# EAGLE design electric-skateboard-v2 (EAGLE 6.6.0)

## Sheet 1 of 2: SIGNAL
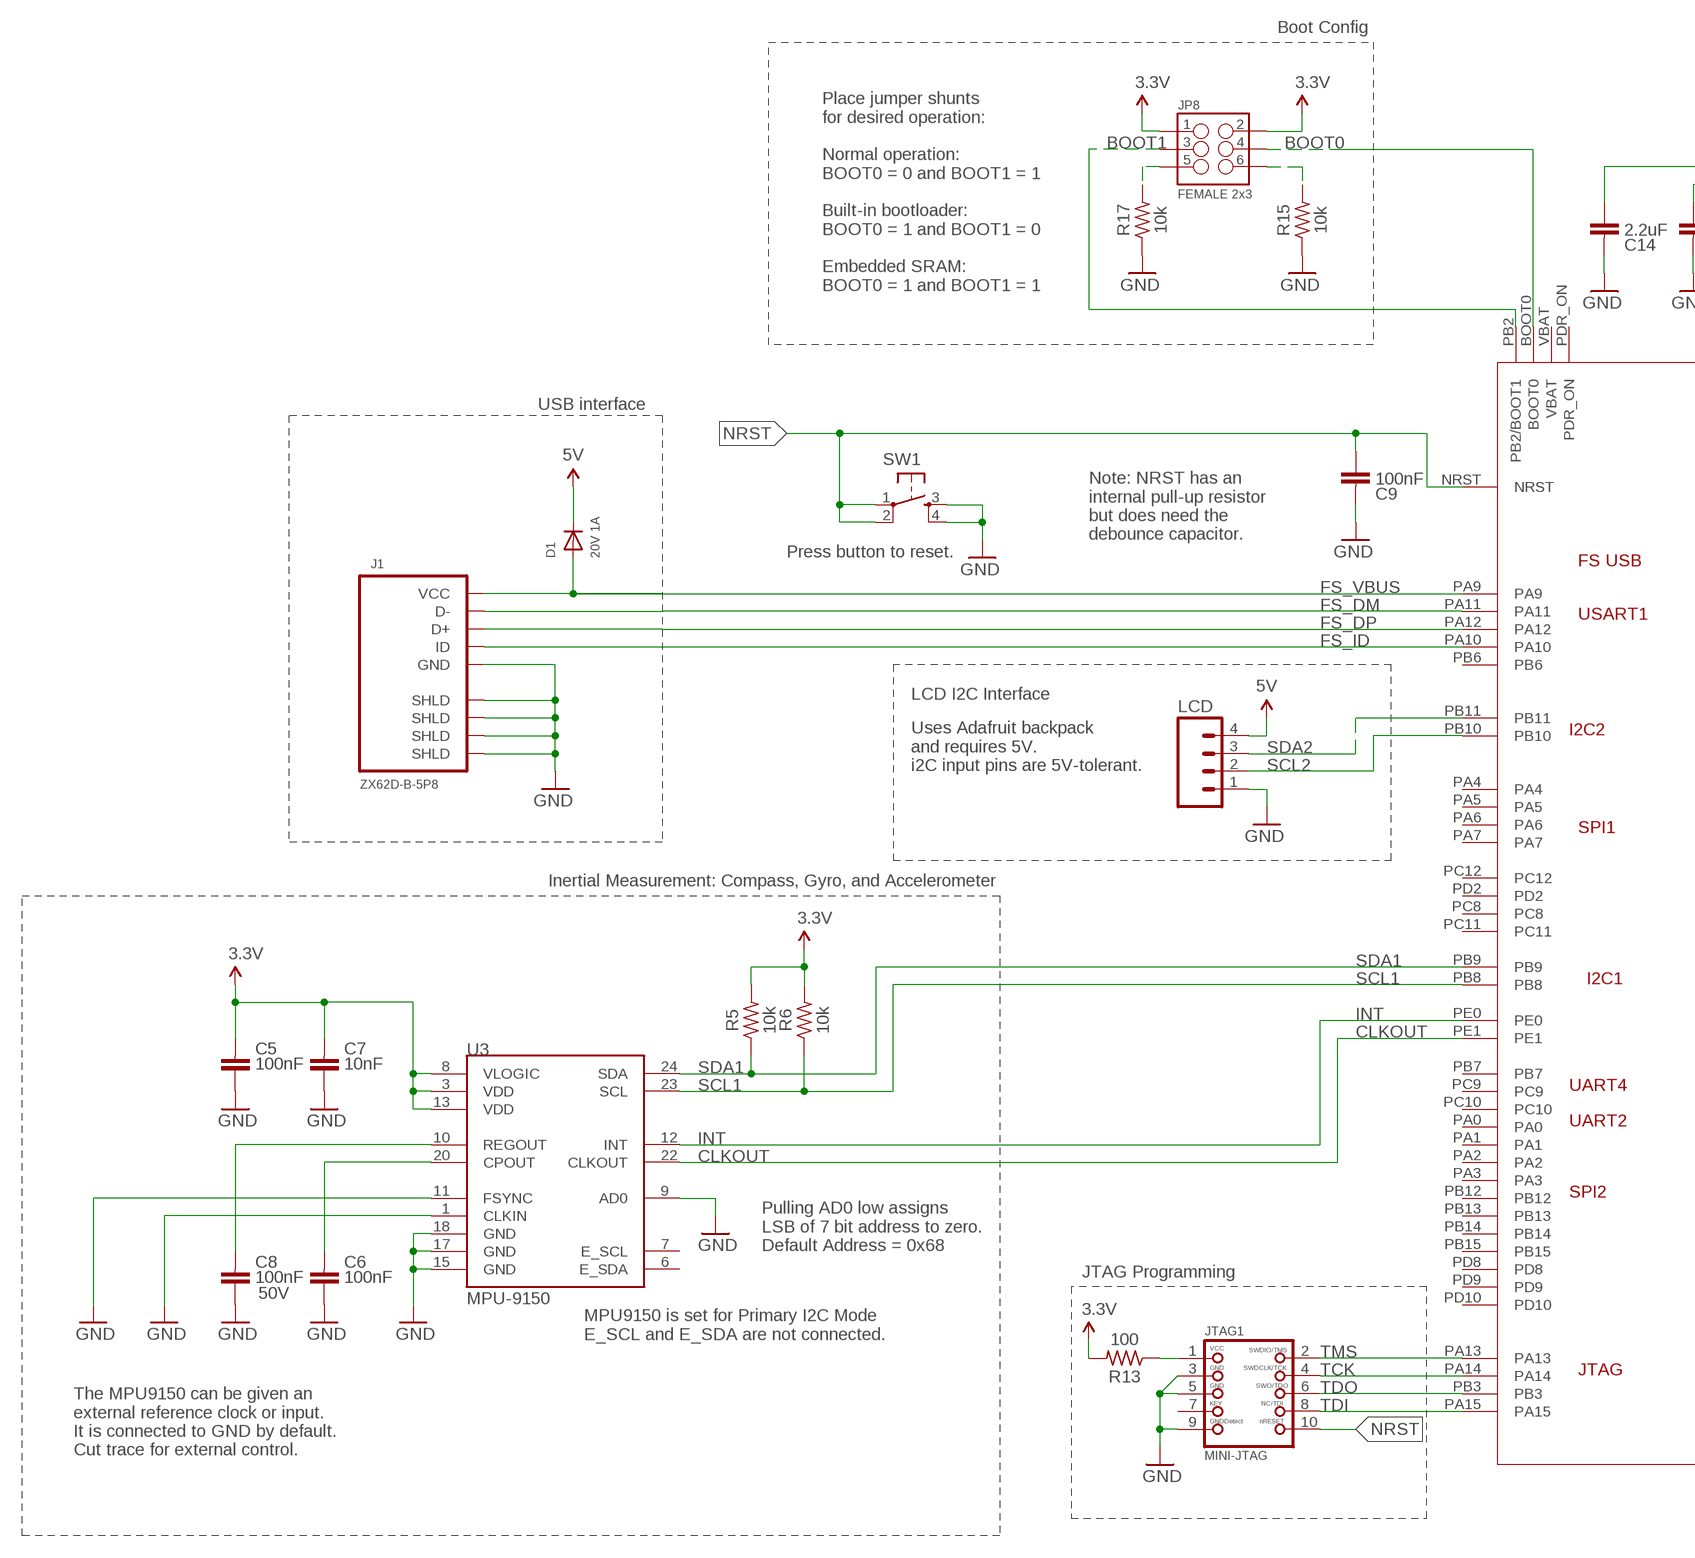
[diagram p0: schematic, sheet 1, part 1 of 2]
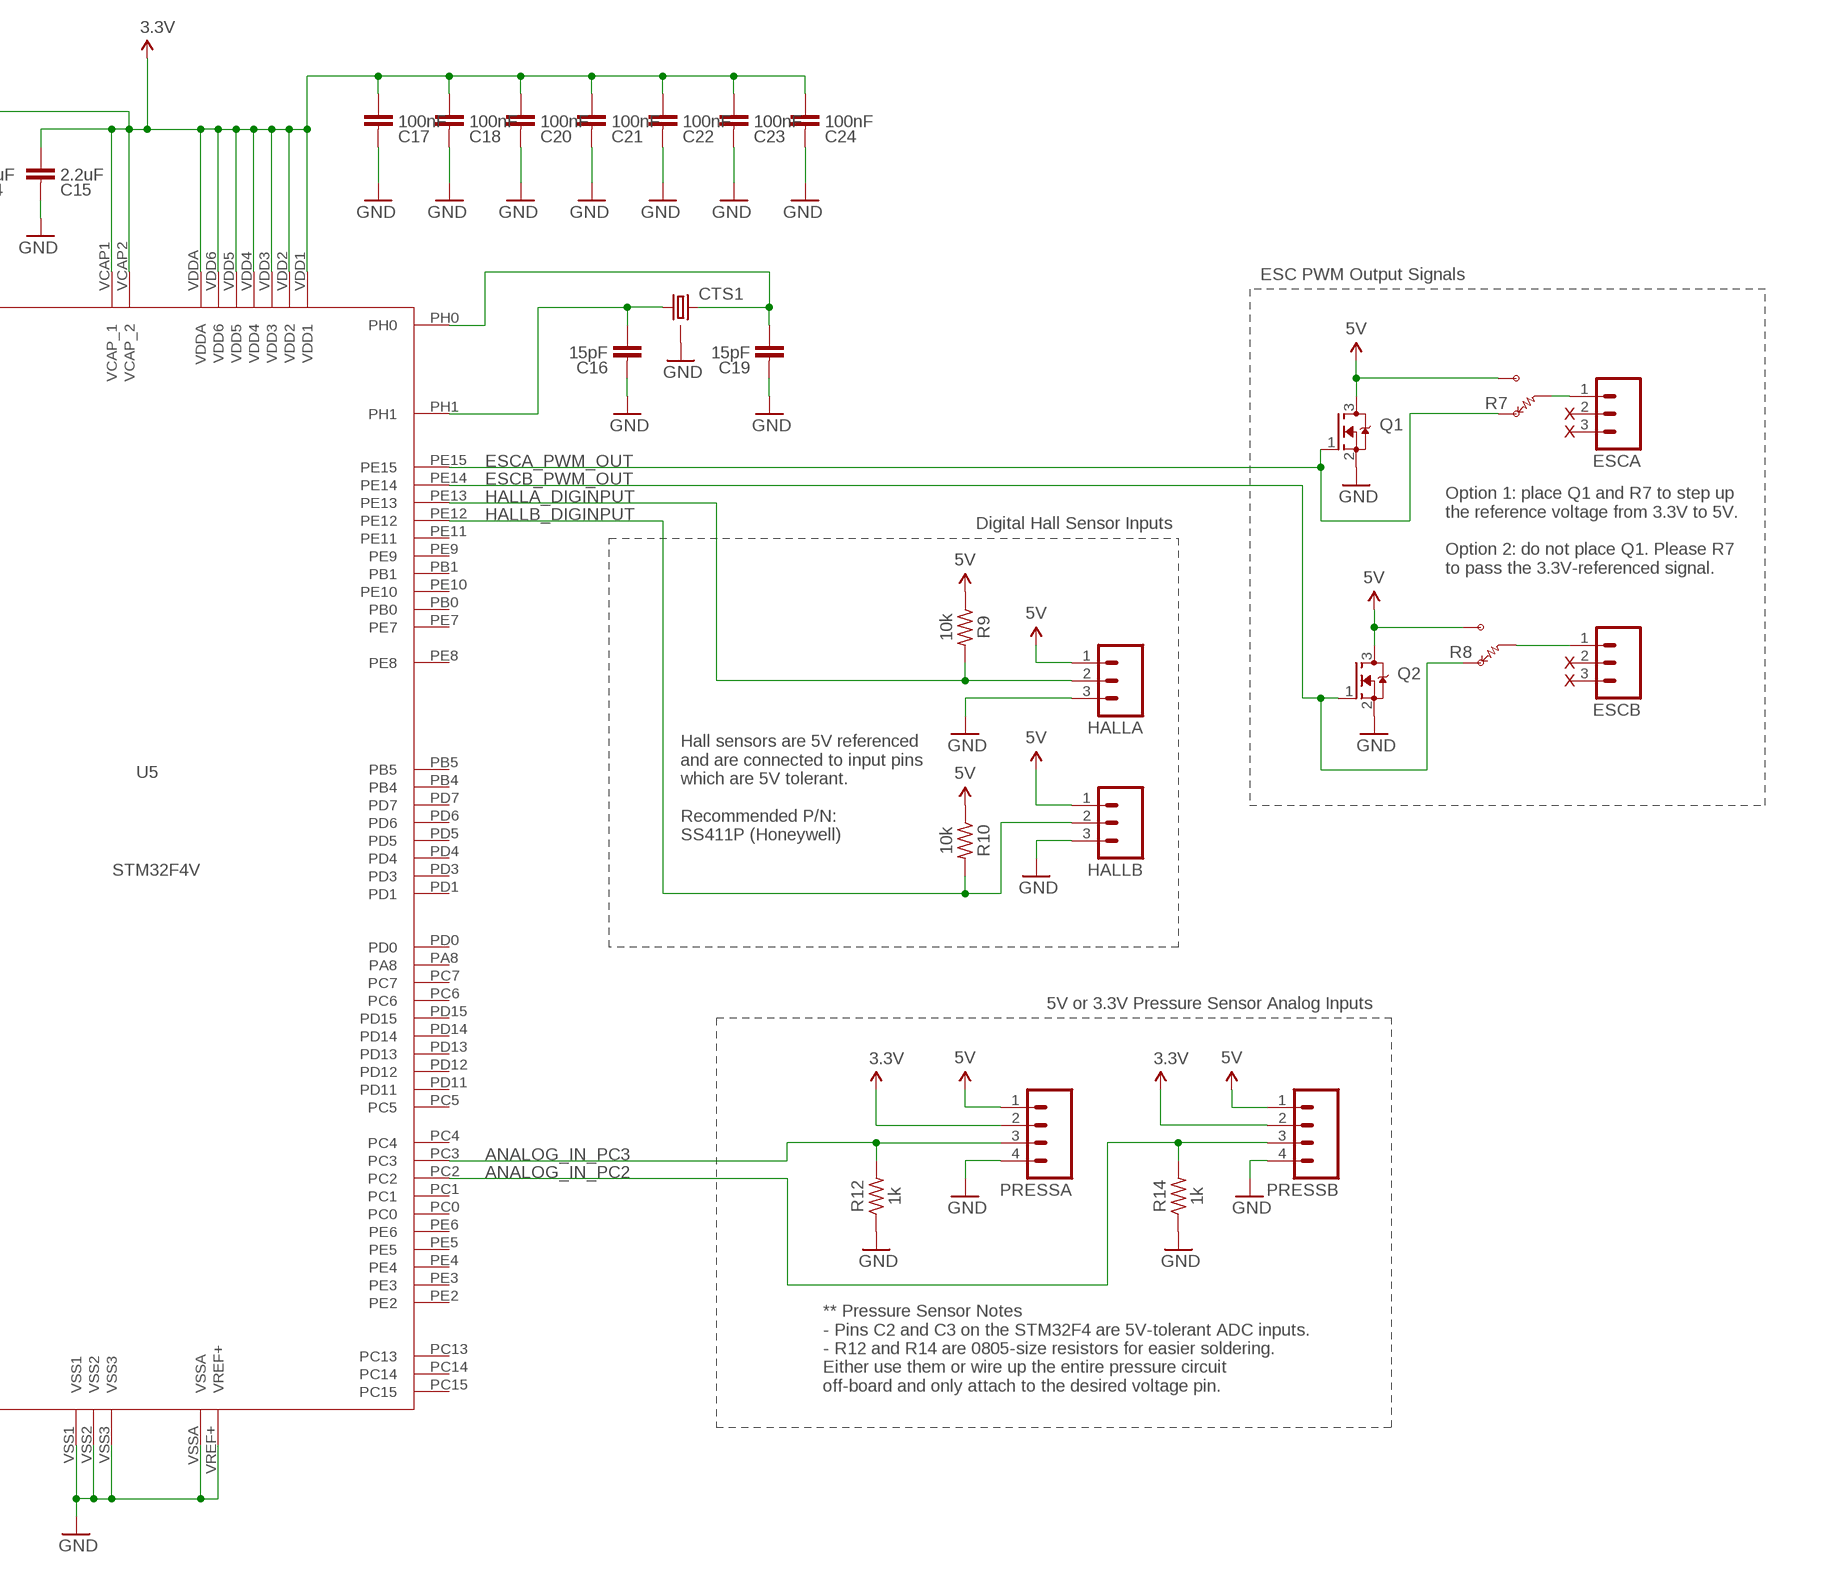
[diagram p1: schematic, sheet 1, part 2 of 2]

### Parts
C5  100nF  CAP-0402  [RLC-0402]
C6  100nF  CAP-0402  [RLC-0402]
C7  10nF  CAP-0402  [RLC-0402]
C8  100nF  CAP-0402  [RLC-0402]
C9  100nF  CAP-0402  [RLC-0402]
C14  2.2uF  CAP-0805  [RLC-0805]
C15  2.2uF  CAP-0805  [RLC-0805]
C16  15pF  CAP-0402  [RLC-0402]
C17  100nF  CAP-0402  [RLC-0402]
C18  100nF  CAP-0402  [RLC-0402]
C19  15pF  CAP-0402  [RLC-0402]
C20  100nF  CAP-0402  [RLC-0402]
C21  100nF  CAP-0402  [RLC-0402]
C22  100nF  CAP-0402  [RLC-0402]
C23  100nF  CAP-0402  [RLC-0402]
C24  100nF  CAP-0402  [RLC-0402]
CTS1  CRYSTALCTS406  [CTS406]
D1  20V 1A  DIODESMA  [SMADIODE]
ESCA  M03LOCK_LONGPADS  [1X03_LOCK_LONGPADS]
ESCB  M03LOCK_LONGPADS  [1X03_LOCK_LONGPADS]
HALLA  M03LOCK_LONGPADS  [1X03_LOCK_LONGPADS]
HALLB  M03LOCK_LONGPADS  [1X03_LOCK_LONGPADS]
J1  ZX62D-B-5P8  [ZX62D-B-5P8]
JP8  FEMALE 2x3  M03X2FEMALE  [2X3]
JTAG1  MINI-JTAG  MICROBUILDER_JTAG-CORTEXM3  [MICROBUILDER_2X05_1.27MM_SMT]
LCD  M04SCREW_LOCK  [SCREWTERMINAL-3.5MM-4_LOCK]
PRESSA  M04LOCK_LONGPADS  [1X04_LOCK_LONGPADS]
PRESSB  M04LOCK_LONGPADS  [1X04_LOCK_LONGPADS]
Q1  NTR4501N-D  [SOT-23]
Q2  NTR4501N-D  [SOT-23]
R5  10k  RES-0402  [RLC-0402]
R6  10k  RES-0402  [RLC-0402]
R7  RES-OPTION  [CAP-OPTION]
R8  RES-OPTION  [CAP-OPTION]
R9  10k  RES-0402  [RLC-0402]
R10  10k  RES-0402  [RLC-0402]
R12  1k  RES-0402  [RLC-0402]
R13  100  RES-0402  [RLC-0402]
R14  1k  RES-0402  [RLC-0402]
R15  10k  RES-0402  [RLC-0402]
R17  10k  RES-0402  [RLC-0402]
SW1  TACTILE-SWITCH-PTH  [TAC-SWITCH-PTH]
U3  MPU-9150  MPU-9150QFN-24-NP  [QFN-24-NP]
U5  STM32F4V  STM32F4_STM32F4V_100PIN_FOXCAR  [STM32F4_LQFP100]

### Nets
3.3V: C5.1 C7.1 C14.2 C15.2 C17.2 C18.2 C20.2 C21.2 C22.2 C23.2 C24.2 JP8.1 JP8.2 PRESSA.2 PRESSB.2 R5.2 R6.2 R13.2 U3.3(VDD) U3.8(VLOGIC) U3.13(VDD) U5.VCAP1(VCAP_1) U5.VCAP2(VCAP_2) U5.VDD1 U5.VDD2 U5.VDD3 U5.VDD4 U5.VDD5 U5.VDD6 U5.VDDA ; also sheet 2
5V: D1.C HALLA.1 HALLB.1 LCD.4 PRESSA.1 PRESSB.1 Q1.3(D) Q2.3(D) R7.3 R8.3 R9.1 R10.1 ; also sheet 2
ANALOG_IN_PC2: PRESSB.3 R14.2 U5.PC2
ANALOG_IN_PC3: PRESSA.3 R12.2 U5.PC3
BOOT0: JP8.4 U5.BOOT0
BOOT1: JP8.3 U5.PB2(PB2/BOOT1)
CLKOUT: U3.22(CLKOUT) U5.PE1
ESCA: ESCA.1 R7.2
ESCA_PWM_OUT: Q1.1(G) R7.1 U5.PE15
ESCB: ESCB.1 R8.2
ESCB_PWM_OUT: Q2.1(G) R8.1 U5.PE14
FS_DM: J1.P2(D-) U5.PA11
FS_DP: J1.P3(D+) U5.PA12
FS_ID: J1.P4(ID) U5.PA10
FS_VBUS: D1.A J1.P1(VCC) U5.PA9
GND: C5.2 C6.2 C7.2 C8.2 C9.1 C14.1 C15.1 C16.1 C17.1 C18.1 C19.1 C20.1 C21.1 C22.1 C23.1 C24.1 CTS1.2(GND) CTS1.4(GND) HALLA.3 HALLB.3 J1.P5(GND) J1.P$1(SHLD) J1.P$2(SHLD) J1.P$3(SHLD) J1.P$4(SHLD) JTAG1.3 JTAG1.5 JTAG1.9 LCD.1 PRESSA.4 PRESSB.4 Q1.2(S) Q2.2(S) R12.1 R14.1 R15.1 R17.1 SW1.3 SW1.4 U3.1(CLKIN) U3.9(AD0) U3.11(FSYNC) U3.15(GND) U3.17(GND) U3.18(GND) U5.VREF+ U5.VSS1 U5.VSS2 U5.VSS3 U5.VSSA ; also sheet 2
HALLA_DIGINPUT: HALLA.2 R9.2 U5.PE13
HALLB_DIGINPUT: HALLB.2 R10.2 U5.PE12
INT: U3.12(INT) U5.PE0
N$4: C6.1 U3.20(CPOUT)
N$5: JP8.6 R15.2
N$6: JP8.5 R17.2
N$11: C8.1 U3.10(REGOUT)
N$20: JTAG1.1 R13.1
NRST: C9.2 JTAG1.10 SW1.1 SW1.2 U5.NRST
OSC_IN1: C19.2 CTS1.3 U5.PH0
OSC_OUT1: C16.2 CTS1.1 U5.PH1
SCL1: R6.1 U3.23(SCL) U5.PB8
SCL2: LCD.2 U5.PB10
SDA1: R5.1 U3.24(SDA) U5.PB9
SDA2: LCD.3 U5.PB11
TCK: JTAG1.4 U5.PA14
TDI: JTAG1.8 U5.PA15
TDO: JTAG1.6 U5.PB3
TMS: JTAG1.2 U5.PA13
Unconnected: ESCA.2 ESCA.3 ESCB.2 ESCB.3 JTAG1.7 U3.6(E_SDA) U3.7(E_SCL) U5.PA0 U5.PA1 U5.PA2 U5.PA3 U5.PA4 U5.PA5 U5.PA6 U5.PA7 U5.PA8 U5.PB0 U5.PB1 U5.PB4 U5.PB5 U5.PB6 U5.PB7 U5.PB12 U5.PB13 U5.PB14 U5.PB15 U5.PC0 U5.PC1 U5.PC4 U5.PC5 U5.PC6 U5.PC7 U5.PC8 U5.PC9 U5.PC10 U5.PC11 U5.PC12 U5.PC13 U5.PC14 U5.PC15 U5.PD0 U5.PD1 U5.PD2 U5.PD3 U5.PD4 U5.PD5 U5.PD6 U5.PD7 U5.PD8 U5.PD9 U5.PD10 U5.PD11 U5.PD12 U5.PD13 U5.PD14 U5.PD15 U5.PDR_ON U5.PE2 U5.PE3 U5.PE4 U5.PE5 U5.PE6 U5.PE7 U5.PE8 U5.PE9 U5.PE10 U5.PE11 U5.VBAT

### Notes on the sheet
- Boot Config
- Place jumper shunts 
  for desired operation:
  
  Normal operation:
  BOOT0 = 0 and BOOT1 = 1
  
  Built-in bootloader:
  BOOT0 = 1 and BOOT1 = 0
  
  Embedded SRAM:
  BOOT0 = 1 and BOOT1 = 1
- ESC PWM Output Signals
- USB interface
- X
- X
- Note: NRST has an
  internal pull-up resistor
  but does need the 
  debounce capacitor.
- Press button to reset.
- Digital Hall Sensor Inputs
- Option 1: place Q1 and R7 to step up 
  the reference voltage from 3.3V to 5V. 
  
  Option 2: do not place Q1. Please R7 
  to pass the 3.3V-referenced signal.
- LCD I2C Interface
- X
- X
- Uses Adafruit backpack
  and requires 5V.
  i2C input pins are 5V-tolerant.
- Inertial Measurement: Compass, Gyro, and Accelerometer
- Hall sensors are 5V referenced
  and are connected to input pins
  which are 5V tolerant.
  
  Recommended P/N:
  SS411P (Honeywell)
- 5V or 3.3V Pressure Sensor Analog Inputs
- Pulling AD0 low assigns
  LSB of 7 bit address to zero.
  Default Address = 0x68
- JTAG Programming
- 50V
- MPU9150 is set for Primary I2C Mode
  E_SCL and E_SDA are not connected.
- ** Pressure Sensor Notes
  - Pins C2 and C3 on the STM32F4 are 5V-tolerant ADC inputs.
  - R12 and R14 are 0805-size resistors for easier soldering. 
  Either use them or wire up the entire pressure circuit 
  off-board and only attach to the desired voltage pin.
- The MPU9150 can be given an
  external reference clock or input.
  It is connected to GND by default.
  Cut trace for external control.

## Sheet 2 of 2: POWER
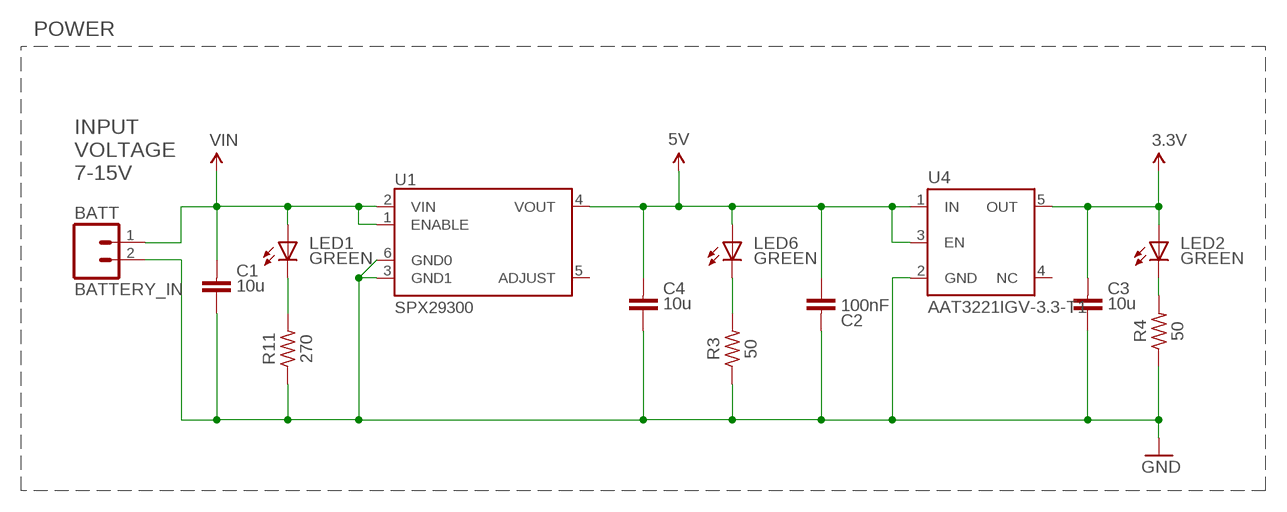
[diagram p2: schematic, sheet 2]

### Parts
BATTERY_IN  BATT  M025MM  [SCREWTERMINAL-5MM-2]
C1  10u  CAP-1210  [RLC-1210]
C2  100nF  CAP-0402  [RLC-0402]
C3  10u  CAP-1210  [RLC-1210]
C4  10u  CAP-1210  [RLC-1210]
LED1  GREEN  BG1111C  [LED0603]
LED2  GREEN  BG1111C  [LED0603]
LED6  GREEN  BG1111C  [LED0603]
R3  50  RES-0402  [RLC-0402]
R4  50  RES-0402  [RLC-0402]
R11  270  RES-0402  [RLC-0402]
U1  SPX29300  VREG_TO263-5  [TO263-5]
U4  AAT3221IGV-3.3-T1  INVERTER_SOT23-5  [SOT23-5]

### Nets
3.3V: C3.1 LED2.A U4.5(OUT) ; also sheet 1
5V: C2.2 C4.1 LED6.A U1.4(VOUT) U4.1(IN) U4.3(EN) ; also sheet 1
GND: BATTERY_IN.2 C1.2 C2.1 C3.2 C4.2 R3.1 R4.1 R11.1 U1.3(GND1) U1.6(GND0) U4.2(GND) ; also sheet 1
N$2: LED2.C R4.2
N$3: LED1.C R11.2
N$8: LED6.C R3.2
VIN: BATTERY_IN.1 C1.1 LED1.A U1.1(ENABLE) U1.2(VIN)
Unconnected: U1.5(ADJUST) U4.4(NC)

### Notes on the sheet
- POWER
- INPUT
  VOLTAGE
  7-15V

## Library data of the parts
BATTERY_IN = SparkFun-Connectors:M02: Standard 2-pin 0.1" header. Use with - straight break away headers ( PRT-00116) - right angle break away headers (PRT-00553) - swiss pins (PRT-00743) - machine pins (PRT-00117) - female headers (PRT-00115) Molex polarized connector foot print use with: PRT-08233 with associated crimp pins and housings. 2.54_SCREWTERM for use with PRT-10571. 3.5mm Screw Terminal footprints for PRT-08084 5mm Screw Terminal footprints for use with PRT-08432; STOREFRONT_ID: PRT-08432
C1 C3 C4 = max-viz:CAP-1210
C2 C5-C9 C16-C24 = max-viz:CAP-0402
C14 C15 = max-viz:CAP-0805
CTS1 = adafruit:CRYSTAL: CRYSTAL; OC_FARNELL: unknown; OC_NEWARK: unknown
D1 = adafruit:DIODE: Diode SMADIODE - SMA Surface Mount Package 20V 1A Schottky Diode Digikey: 641-1014-6-ND DO-1N4148 - Through Hole Small Current Diode SOD-123 20V 1 A (.5mV Vf) Schottky Diode - Digikey: MBRX120TPMSCT-ND SOD-323 10V 570mA (.38mV Vf, 3ns) Schottky Diode - Digikey: ZLLS410CT-ND SOD-523 30V 30mA Schottky Diode (RB751S-40TE61) - Digikey: RB751S-40TE61CT-ND SOT23-R/W - SOT23 Package (R = Solder Paste/Reflow Ovens, W = Hand-Soldering) BAT54Film 40V 300mA - Digikey: 497-7162-1-ND
ESCA ESCB HALLA HALLB = SparkFun-Connectors:M03: Header 3 Standard 3-pin 0.1" header. Use with straight break away headers (SKU : PRT-00116), right angle break away headers (PRT-00553), swiss pins (PRT-00743), machine pins (PRT-00117), and female headers (PRT-00115). Molex polarized connector foot print use with SKU : PRT-08232 with associated crimp pins and housings.
J1 = con-hirose-microusb:ZX62D-B-5P8
JP8 = SparkFun-Connectors:M03X2: 2x3 .1" header. Shrouded, with keying- CONN-10681 SMT- CONN-11415 Pogo pins- HW-11044; PROD_ID: CONN-11566
JTAG1 = foxcar-control-board-v1:MICROBUILDER_JTAG-CORTEXM3: Serial Wire (SW-DP) Connector This standard 0.05" 10-pin connector is for use with the Cortex M0/M3's native SWD (serial wire debugger) interface (SW-DP). Some boards support a 20-pin combined JTAG+SWD connector (SWJ-DP), such as the LPC1700 family, but many smaller devices only work with SWD which typically use the smaller 10-pin SW-DP connecter (the LPC1300 family, for example, only supports SWD). 2x05 1.27mm/0.05" Connector: This is the standard SMT connector defined by ARM for all Cortex devices, and should be used in most situations and for forward-compatibility since any new devices coming to market will likely use this connector. MOLEX 10 Pin 0.1" Connector: This 0.1" 10 pin connector has the same pin layout as the standard 0.05" connector, but is easier to work with if you are using standard jumper wires or custom cables to connect your SWD hardware. MOLEX 20 Pin 0.1" Connector: This 0.1" 20 pin connector is the same model used for ARM7/ARM9 JTAG debuggers, but is connected to match the pins on the Segger J-Link for ARM (which supports both JTAG and SWD debugging). See the following document from ARM for more information on Cortex M3 Debug Connectors: http://infocenter.arm.com/help/topic/com.arm.doc.faqs/attached/13634/cortex_debug_connectors.pdf And the following page for an overview with images of the different connector types: http://www.keil.com/peripherals/coresight/connectors.asp
LCD PRESSA PRESSB = SparkFun-Connectors:M04: Header 4 Standard 4-pin 0.1" header. Use with straight break away headers (SKU : PRT-00116), right angle break away headers (PRT-00553), swiss pins (PRT-00743), machine pins (PRT-00117), and female headers (PRT-00115). Molex polarized connector foot print use with SKU : PRT-08231 with associated crimp pins and housings. 1MM SMD Version SKU: PRT-10208
LED1 LED2 LED6 = max-viz:BG1111C
Q1 Q2 = max-viz:NTR4501N-D
R3-R6 R9-R15 R17 = max-viz:RES-0402
R7 R8 = wicker:RES-OPTION
SW1 = GeekAmmo:TACTILE-SWITCH: Tactile Switch 4 Pins, SPST NO
U1 = microbuilder:VREG_TO263-5: TO263-5 Linear Voltage Regulators LD29300xx - 3A LDO (Vf: 0.4V@3A, 0.2V@1A) - Digikey: 3.3V - 497-3475-1-ND
U3 = SparkFun-Sensors:MPU-9150: 9DOF (3mag, 3accel, 3rotat). I2C interface.
U4 = SparkFun-DigitalIC:INVERTER: Single inverter, SOT23-5; NOTE: RETIRED; PROD_ID: 8211; VALUE: TC7SU04F
U5 = foxcar-control-board-v1:STM32F4_STM32F4V_100PIN_FOXCAR

## Board
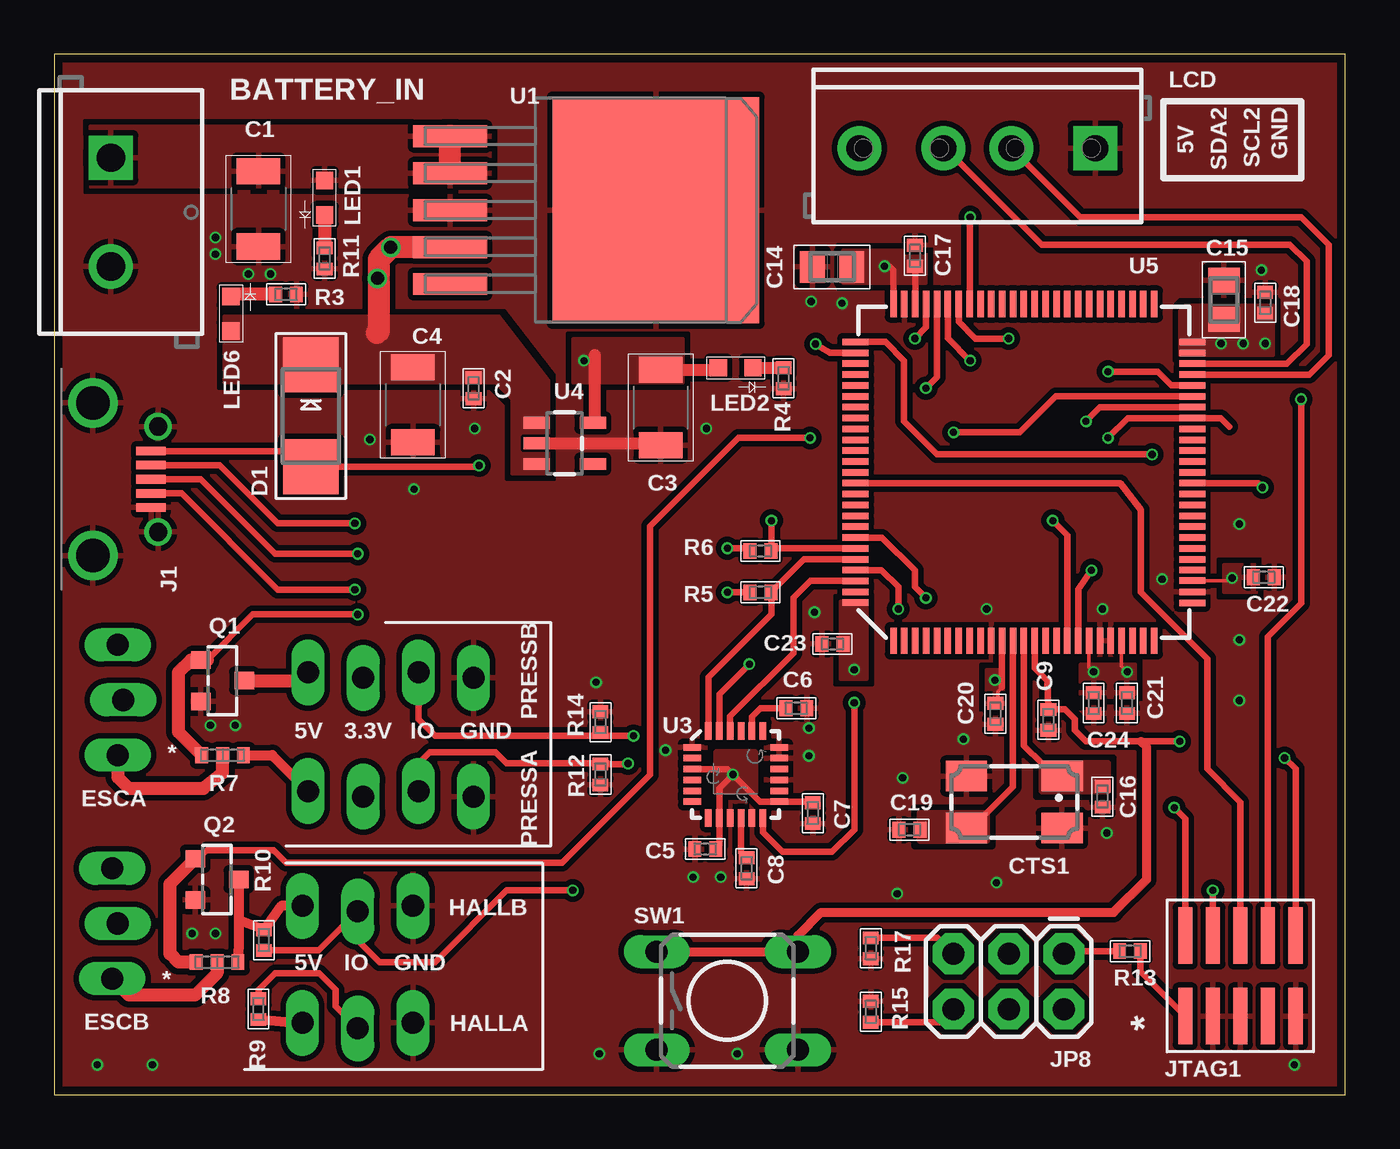
[diagram p3: board, top side]
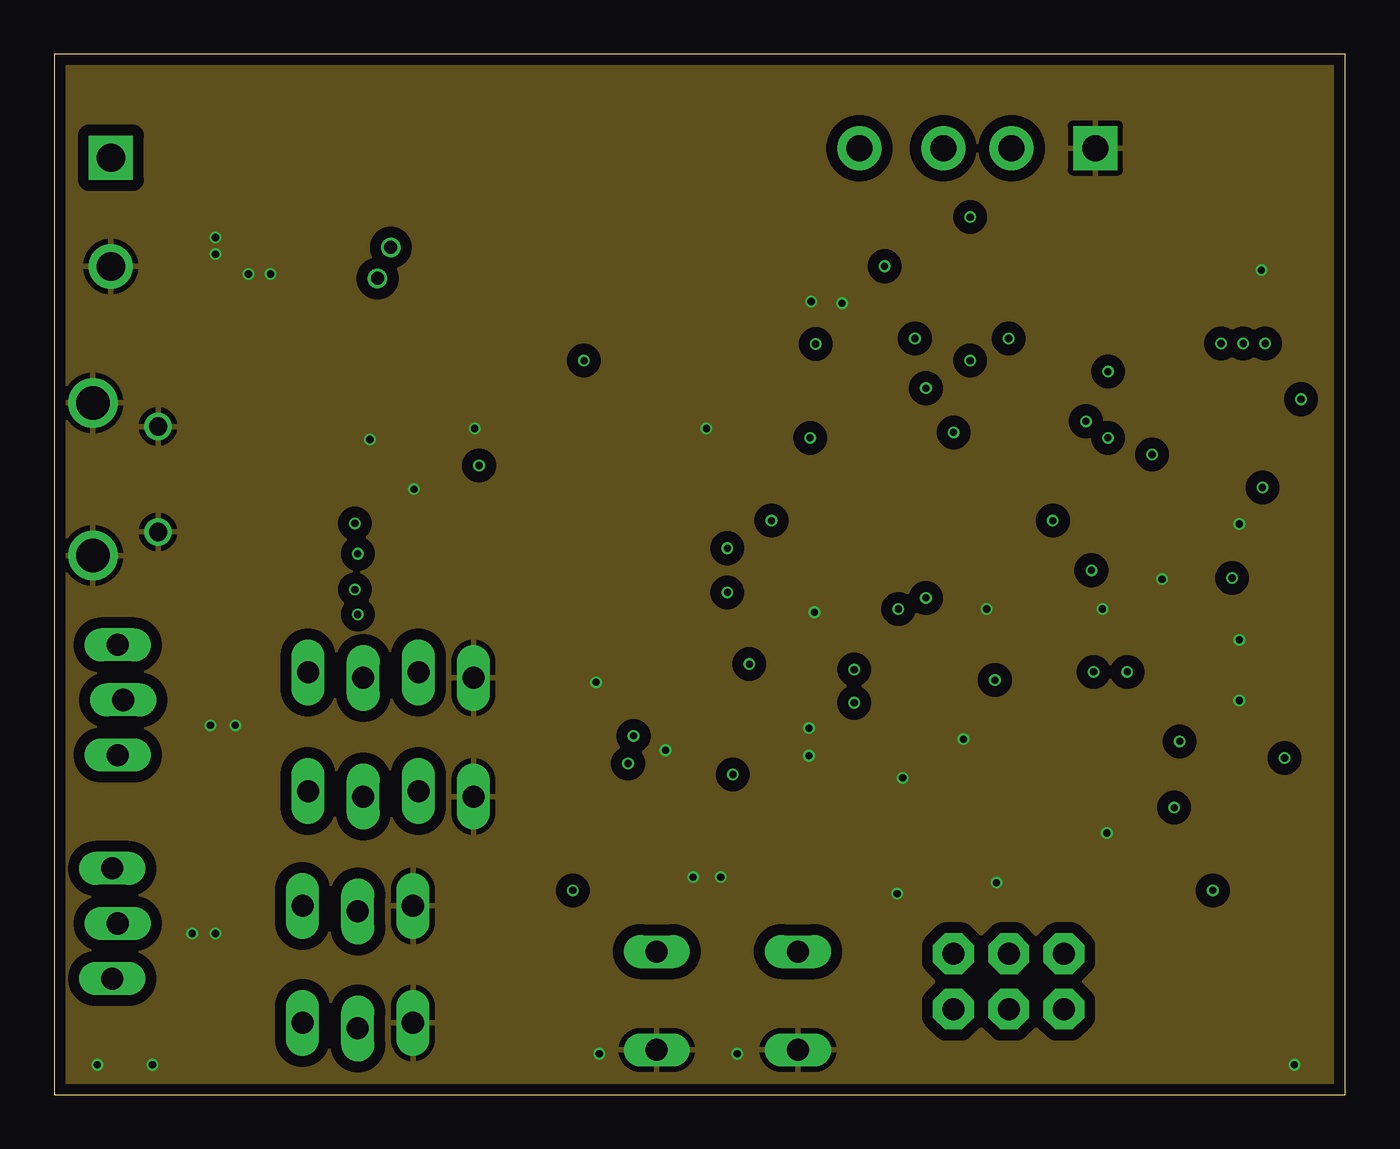
[diagram p4: board, inner layer GND]
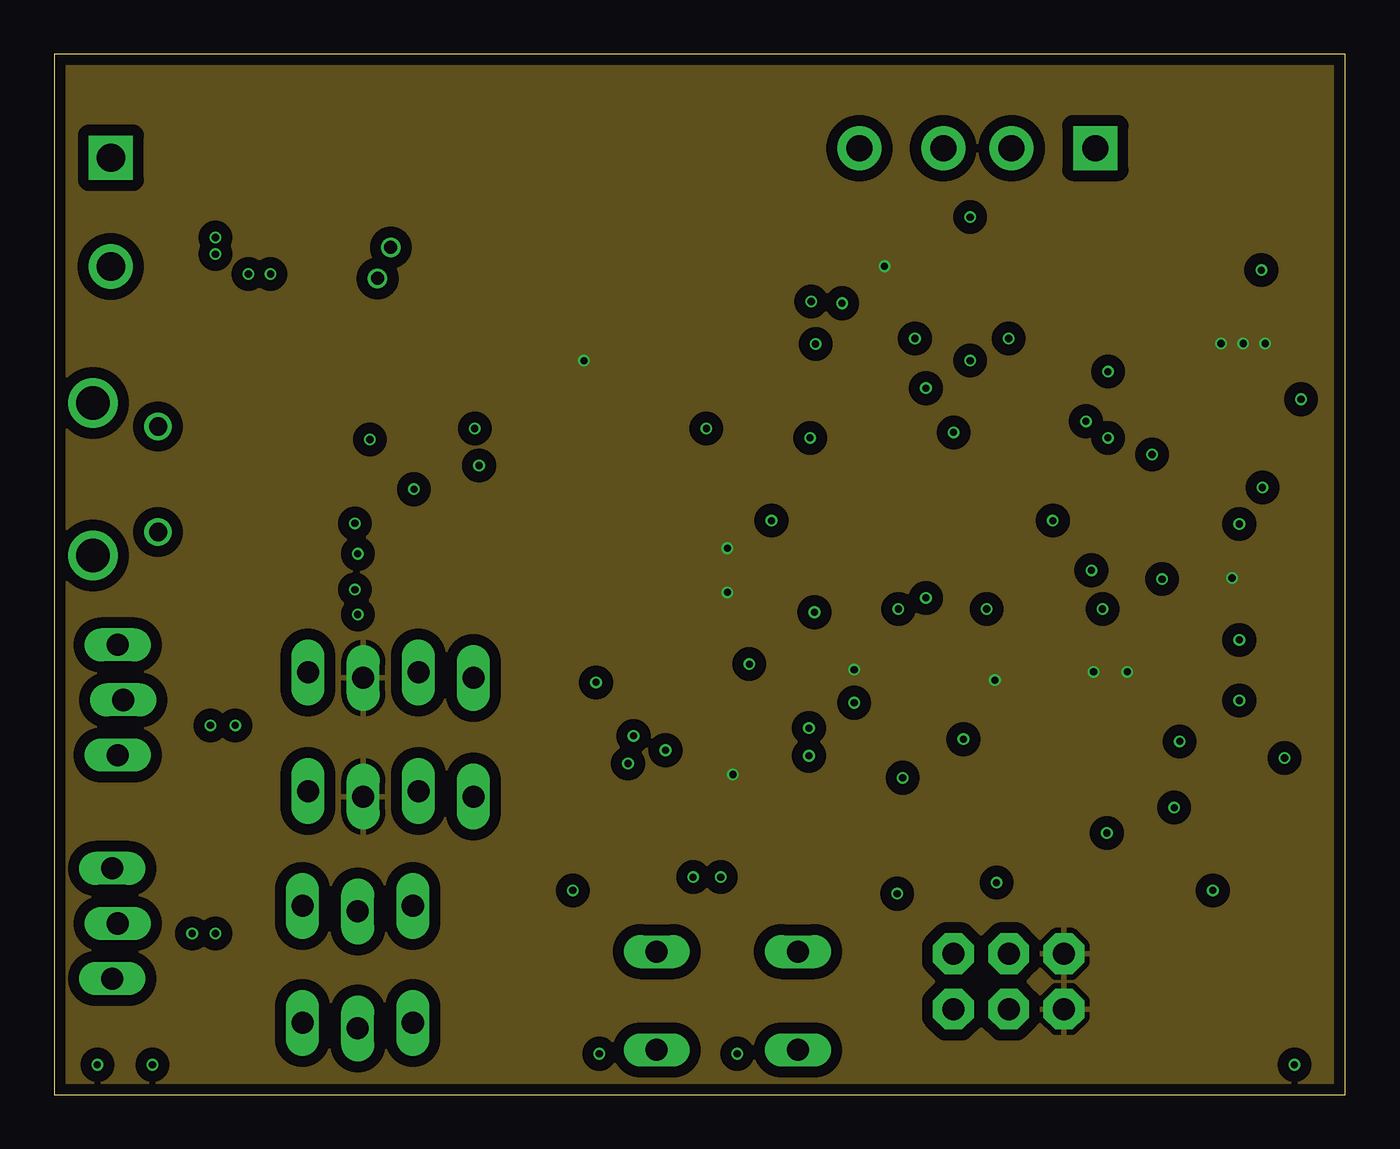
[diagram p5: board, inner layer 3.3V]
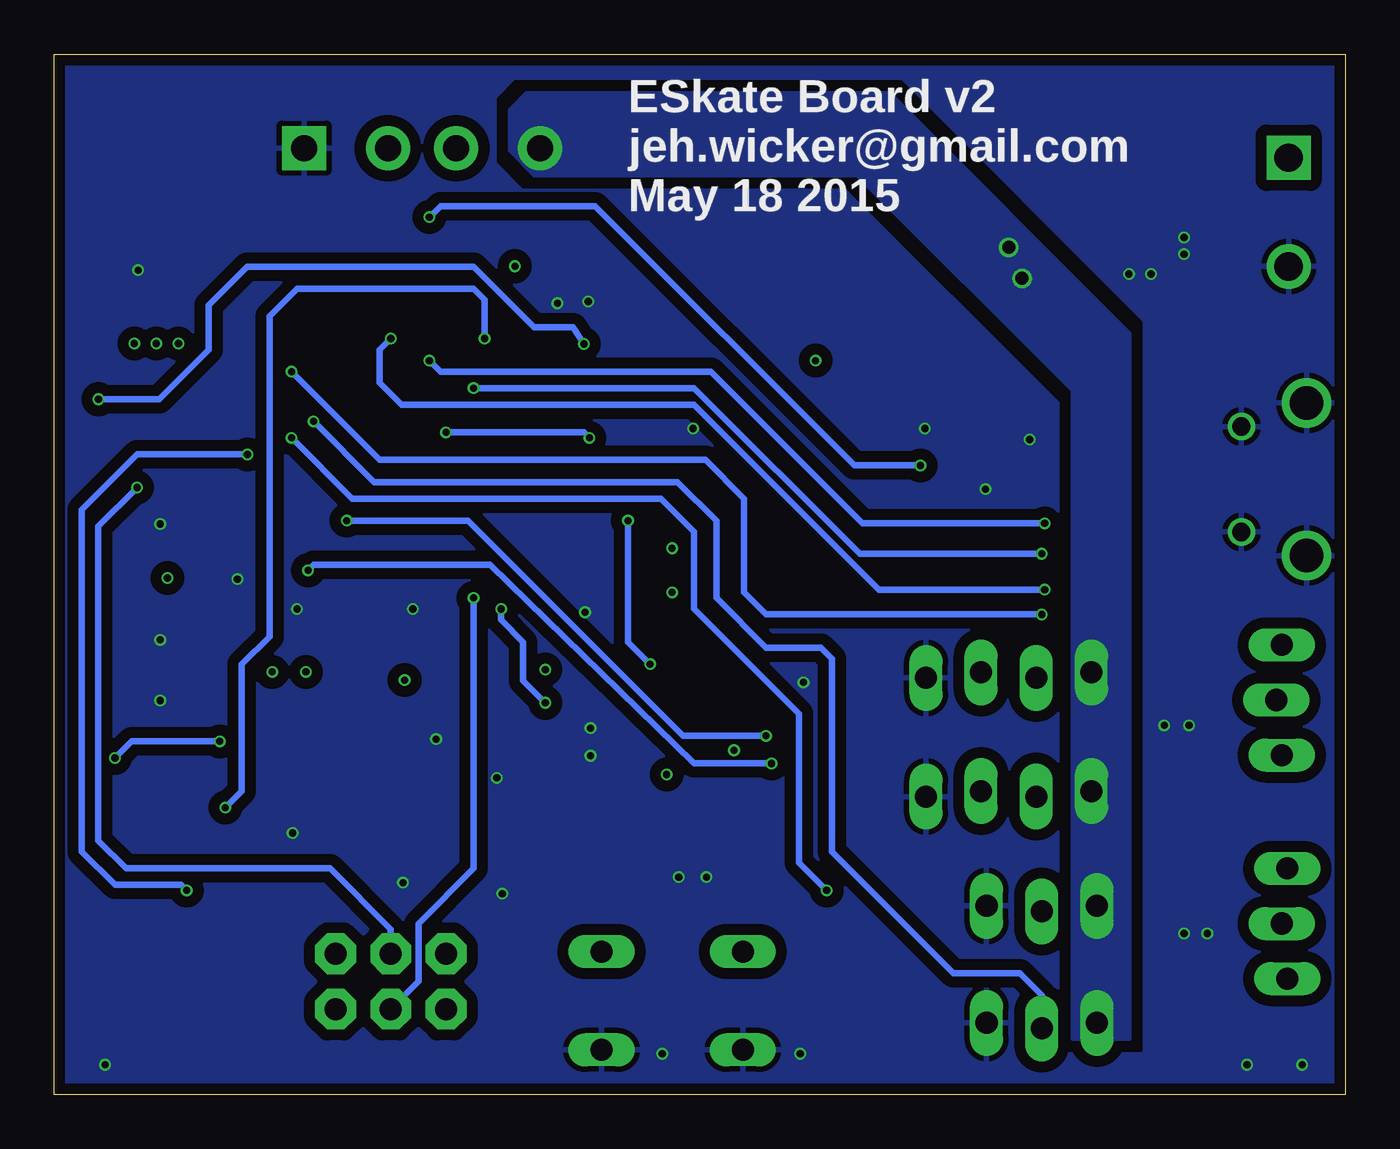
[diagram p6: board, bottom side, seen from below]

Size 59.44 x 47.88 mm. Coordinates in mm from the lower left corner, seen from the top.
Outline: 0,0 59.44,0 59.44,47.88 0,47.88 0,0
Copper layers (1*2*15*16): Top 0.035559375mm / dielectric 0.17018125mm / GND 0.01778125mm / dielectric 47mil / 3.3V 0.01778125mm / dielectric 0.17018125mm / Bottom 0.035559375mm
Design rules "OSHPark-4layer": minimum track width 5mil, minimum drill 10mil, track to track 5mil, track to pad 5mil, pad to pad 5mil, via to via 5mil, smd to smd 5mil, copper to edge 15mil, drill to drill 6mil, minimum pad ring 4mil, minimum via ring 4mil, stop-mask expansion 4mil, vias tented up to drill 0mil, thermal gap 10mil

### Footprints (pad centres in the part's own frame; a part is rotated, then mirrored left to right if it is on the bottom)
SCREWTERMINAL-5MM-2 = drill 1.3 pad 2.032 square: 1 0,0 | drill 1.3 pad 2.032: 2 5,0
RLC-1210 = smd 1.2 x 2: 1 -1.735,0; 2 1.735,0
RLC-0402 = smd 0.59 x 0.72: 1 -0.48,0; 2 0.48,0
RLC-0805 = smd 1.15 x 1.45: 1 -0.9,0; 2 0.9,0
CTS406 = smd 1.9 x 1.4: 1 -2.2,-1.2; 2 2.2,-1.2; 3 2.2,1.2; 4 -2.2,1.2
SMADIODE = smd 2.54 x 2.54: A 2.349,0; C -2.349,0
1X03_LOCK_LONGPADS = drill 1.016 long: 1 0,0; 2 2.54,-0.254; 3 5.08,0
ZX62D-B-5P8 = smd 0.4 x 1.35: P1 -1.3,2.675; P2 -0.65,2.675; P3 0,2.675; P4 0.65,2.675; P5 1.3,2.675 | drill 1.524: P$1 3.51,0; P$2 -3.51,0 | drill 0.838: P$3 -2.425,3; P$4 2.425,3
2X3 = drill 1.016 pad 1.88 octagon: 1 0,0; 2 0,2.54; 3 2.54,0; 4 2.54,2.54; 5 5.08,0; 6 5.08,2.54
MICROBUILDER_2X05_1.27MM_SMT = smd 0.65 x 2.6: 1 -2.54,-1.85; 2 -2.54,1.85; 3 -1.27,-1.85; 4 -1.27,1.85; 5 0,-1.85; 6 0,1.85; 7 1.27,-1.85; 8 1.27,1.85; 9 2.54,-1.85; 10 2.54,1.85
SCREWTERMINAL-3.5MM-4_LOCK = drill 1.2 pad 2.032 square: 1 -0.178,0 | drill 1.2 pad 2.032: 2 3.678,0; 3 6.822,0; 4 10.678,0
LED0603 = smd 0.8 x 0.8: A 0,0.8; C 0,-0.8
1X04_LOCK_LONGPADS = drill 1.016 long: 1 0,0; 2 2.54,-0.254; 3 5.08,0; 4 7.62,-0.254
SOT-23 = smd 0.8 x 0.9: 1 -0.95,-1; 2 0.95,-1; 3 0,1
CAP-OPTION = smd 0.59 x 0.72: 1 -0.96,0; 2 0,0; 3 0.96,0
TAC-SWITCH-PTH = drill 1.016 pad 1.524 long: 1 -3.251,2.261; 2 3.251,2.261; 3 -3.251,-2.261; 4 3.251,-2.261
TO263-5 = smd 1 x 3.4: 1 -3.4,-7.875; 2 -1.7,-7.875; 3 0,-7.875; 4 1.7,-7.875; 5 3.4,-7.875 | smd 10.414 x 9.525: 6 0,1.595
QFN-24-NP = smd 0.8 x 0.3: 1 -2,1.25; 2 -2,0.75; 3 -2,0.25; 4 -2,-0.25; 5 -2,-0.75; 6 -2,-1.25; 13 2,-1.25; 14 2,-0.75; 15 2,-0.25; 16 2,0.25; 17 2,0.75; 18 2,1.25 | smd 0.3 x 0.8: 7 -1.25,-2; 8 -0.75,-2; 9 -0.25,-2; 10 0.25,-2; 11 0.75,-2; 12 1.25,-2; 19 1.25,2; 20 0.75,2; 21 0.25,2; 22 -0.25,2; 23 -0.75,2; 24 -1.25,2
SOT23-5 = smd 0.55 x 1.2: 1 -0.95,-1.3; 2 0,-1.3; 3 0.95,-1.3; 4 0.95,1.3; 5 -0.95,1.3
STM32F4_LQFP100 = smd 1.2 x 0.3: BOOT0 -7.75,-3; PA3 7.75,-6.016; PA4 7.75,-4.5; PA5 7.75,-4; PA6 7.75,-3.5; PA7 7.75,-3; PA14 -7.75,6; PA15 -7.75,5.5; PB0 7.75,-1.5; PB1 7.75,-1; PB2 7.75,-0.5; PB3 -7.75,-0.5; PB4 -7.75,-1; PB5 -7.75,-1.5; PB6 -7.75,-2; PB7 -7.75,-2.5; PB8 -7.75,-3.5; PB9 -7.75,-4; PB10 7.75,4.5; PB11 7.75,5; PC4 7.75,-2.5; PC5 7.75,-2; PC10 -7.75,5; PC11 -7.75,4.5; PC12 -7.75,4; PD0 -7.75,3.5; PD1 -7.75,3; PD2 -7.75,2.5; PD3 -7.75,2; PD4 -7.75,1.5; PD5 -7.75,1; PD6 -7.75,0.5; PD7 -7.75,0; PDR_ON -7.75,-5.5; PE0 -7.75,-4.5; PE1 -7.75,-5; PE7 7.75,0; PE8 7.75,0.5; PE9 7.75,1; PE10 7.75,1.5; PE11 7.75,2; PE12 7.75,2.5; PE13 7.75,3; PE14 7.75,3.5; PE15 7.75,4; VCAP1 7.75,5.5; VDD3 7.75,-4.984; VDD4 7.75,6; VDD6 -7.75,-6; VSS2 7.75,-5.5 | smd 0.3 x 1.2: NRST 0.5,-7.75; PA0 5,-7.75; PA1 5.5,-7.75; PA2 6,-7.75; PA8 -2,7.75; PA9 -2.5,7.75; PA10 -3,7.75; PA11 -3.5,7.75; PA12 -4,7.75; PA13 -4.5,7.75; PB12 6,7.75; PB13 5.5,7.75; PB14 5,7.75; PB15 4.5,7.75; PC0 1,-7.75; PC1 1.5,-7.75; PC2 2,-7.75; PC3 2.5,-7.75; PC6 0,7.75; PC7 -0.5,7.75; PC8 -1,7.75; PC9 -1.5,7.75; PC13 -3,-7.75; PC14 -2.5,-7.75; PC15 -2,-7.75; PD8 4,7.75; PD9 3.5,7.75; PD10 3,7.75; PD11 2.5,7.75; PD12 2,7.75; PD13 1.5,7.75; PD14 1,7.75; PD15 0.5,7.75; PE2 -6,-7.75; PE3 -5.5,-7.75; PE4 -5,-7.75; PE5 -4.5,-7.75; PE6 -4,-7.75; PH0 -0.5,-7.75; PH1 0,-7.75; VBAT -3.5,-7.75; VCAP2 -5,7.75; VDD1 -1,-7.75; VDD2 3,-7.75; VDD5 -6,7.75; VDDA 4.5,-7.75; VREF+ 4,-7.75; VSS1 -1.5,-7.75; VSS3 -5.5,7.75; VSSA 3.5,-7.75

### Placement (x,y rotation side)
BATTERY_IN  2.6,43.12 270 top
C1  9.4,40.77 270 top
C2  19.3,32.51 90 top
C3  27.91,31.62 270 top
C4  16.51,31.75 270 top
C5  29.97,11.3 180 top
C6  34.16,17.78 0 top
C7  34.92,12.95 270 top
C8  31.88,10.41 270 top
C9  45.77,17.25 90 top
C14  35.81,38.1 0 top
C15  53.85,36.58 270 top
C16  48.26,13.72 90 top
C17  39.62,38.61 270 top
C18  55.75,36.45 270 top
C19  39.37,12.19 0 top
C20  43.33,17.53 90 top
C21  49.39,18.02 90 top
C22  55.69,23.81 180 top
C23  35.83,20.74 0 top
C24  47.85,18.02 90 top
CTS1  44.2,13.46 180 top
D1  11.81,31.24 270 top
ESCA  2.92,15.62 90 top
ESCB  2.67,5.33 90 top
HALLA  11.43,3.3 0 top
HALLB  11.43,8.69 0 top
J1  1.78,28.32 270 top
JP8  46.48,6.48 180 top
JTAG1  54.61,5.46 0 top
LCD  47.75,43.56 180 top
LED1  12.45,41.27 0 top
LED2  31.37,33.45 90 top
LED6  8.13,35.94 180 top
PRESSA  11.68,13.97 0 top
PRESSB  11.68,19.43 0 top
Q1  7.75,19.05 270 top
Q2  7.49,9.91 270 top
R3  10.67,36.83 180 top
R4  33.58,32.97 90 top
R5  32.51,23.11 180 top
R6  32.51,25.02 180 top
R7  7.75,15.62 0 top
R8  7.49,6.1 0 top
R9  9.4,3.94 90 top
R10  9.65,7.11 270 top
R11  12.45,38.48 90 top
R12  25.15,14.73 90 top
R13  49.53,6.6 180 top
R14  25.15,17.14 270 top
R15  37.59,3.81 270 top
R17  37.59,6.73 90 top
SW1  30.99,4.32 0 top
U1  26.1,40.7 270 top
U3  31.37,14.73 0 top
U4  23.5,29.97 270 top
U5  44.64,28.64 0 top

### Tracks (layer width: path | path; a pad name or v marks a point on that pad's centre or on a via)
3.3V  (via drill 0.33)
  Top 0.152: 43.64,18.75 43.43,18.54 43.43,18.11 C20.2 | U5.VDD2 47.64,19.67 v47.85,19.46 | U5.VDDA 49.14,19.72 v49.4,19.46 | U5.VDD3 54.13,23.65 54.36,23.88
  Top 0.305: U5.VDD5 38.64,37.94 38.48,38.1 | v30.99,25.15 31.91,25.15 R6.2 | v30.99,23.11 R5.2 | U3.3 30.99,14.98 v31.24,14.73 | v31.24,14.73 32.49,13.48 U3.13 34.88,13.48 C7.1 | v31.24,14.73 30.62,14.11 U3.8 30.62,11.47 C5.1 | U5.VDD1 43.64,18.75 | U5.VCAP2 39.64,38.11 C17.2 | R13.2 46.61,6.6 JP8.1
  Top 0.559: U4.5 24.89,30.92 24.89,34.04 | C3.1 30.57,33.36 LED2.A
  other vias: 24.38,33.78 36.83,19.56 43.31,19.08 53.72,34.57 54.74,34.57 55.75,34.57 54.23,23.77 38.23,38.13
  pour Top (no thermals): 51.82,34.04 56.13,34.04 56.13,36.32 52.07,36.32 51.82,36.07
  pour Top (no thermals): 40.13,37.34 36.32,37.34 36.32,38.86 40.13,38.86
  pour Top (no thermals): 37.41,22.71 37.41,19.13 36.2,19.13 36.2,22.71
  pour 3.3V (isolate 0.508, rank 5): -0.76,48.39 -0.51,-0.51 59.69,-0.76 59.69,48.39
  pour Top (no thermals): 28.96,34.8 23.88,34.8 23.88,32.77 28.96,32.77
  pour Top: 30.48,15.75 30.48,13.97 32.26,13.97 32.26,15.75
  pour Top: 42.93,17.78 42.93,19.56 43.69,19.56 43.69,17.78
  pour Top: 49.78,18.29 49.78,19.81 47.24,19.81 47.24,18.29
  pour Top: 55.37,23.11 55.37,24.38 53.85,24.38 53.85,23.11
5V  (via drill 0.6)
  Top 0.457: R7.3 10.03,15.62 PRESSA.1 | Q2.3 8.49,8 | 8.49,8 8.49,6.9 R8.3 | 8.49,8 8.51,8.02 R10.1 10.45,8.69 HALLB.1 | R9.1 11.41,3.29 HALLA.1
  Top 0.61: PRESSB.1 11.3,19.05 Q1.3 8.71,19.01
  Top 1.016: U1.4 15.51,39 v15.49,38.99 14.94,38.44 14.94,35.14 14.86,35.05
  other vias: 14.88,37.57
  pour Top (no thermals): 22.76,32.87 20.47,35.81 7.82,35.81 7.82,32.77 20.32,32.77 21.08,32 21.08,28.57 22.76,28.55
  pour Bottom (no thermals): 37.72,46.1 20.95,46.1 9.91,35.05 9.91,2.54 12.57,2.54 12.57,32.38 22.48,42.29 37.34,42.29 38.48,43.43 38.48,45.34
ANALOG_IN_PC2  (via drill 0.33)
  Top 0.305: PRESSB.3 16.76,17.27 17.53,16.51 24.99,16.51 R14.2 25.3,16.51 v26.67,16.51 | U5.PC2 46.64,25.75 v45.97,26.42
  Bottom 0.305: v26.67,16.51 30.48,16.51 40.39,26.42 v45.97,26.42
ANALOG_IN_PC3  (via drill 0.33)
  Top 0.305: U5.PC3 47.14,23.27 v47.75,24.13 | PRESSA.3 16.76,15.24 17.27,15.75 20.32,15.75 20.83,15.24 25.5,15.24 R12.2 26.39,15.21 v26.42,15.24
  Bottom 0.305: v26.42,15.24 29.97,15.24 39.37,24.38 47.5,24.38 v47.75,24.13
BOOT0  (via drill 0.33)
  Top 0.305: U5.BOOT0 38.12,25.64 39.62,24.13 39.62,23.37 v40.13,22.86
  Bottom 0.305: v40.13,22.86 40.13,10.41 42.67,7.87 42.67,5.21 JP8.4
BOOT1  (via drill 0.33)
  Top 0.305: U5.PB2 55.43,28.14 v55.63,27.94
  Bottom 0.305: JP8.3 43.94,7.62 46.74,10.41 56.13,10.41 57.4,11.68 57.4,26.16 v55.63,27.94
CLKOUT
  Top 0.305: U5.PE1 34.81,23.64 34.04,22.86 34.04,20.32 31.12,17.4 U3.22
ESCA
  Top 0.61: ESCA.1 2.92,14.61 3.43,14.1 6.86,14.1 7.75,14.81 R7.2
ESCA_PWM_OUT  (via drill 0.33)
  Top 0.305: U5.PE15 51.44,32.64 50.8,33.27 v48.51,33.27 | 7.05,20 9.14,22.1 v13.97,22.1
  Top 0.61: R7.1 5.71,16.69 5.71,19.43 6.28,20 Q1.1 7.05,20
  Bottom 0.305: v48.51,33.27 44.45,29.21 29.46,29.21 27.69,27.43 27.69,23.11 26.67,22.1 v13.97,22.1
ESCB
  Top 0.61: R8.2 7.49,5.59 6.48,4.57 3.43,4.57 ESCB.1
ESCB_PWM_OUT  (via drill 0.33)
  Top 0.305: Q2.1 7.05,11.24 10.1,11.24 10.67,10.67 23.37,10.67 27.43,14.73 27.43,26.16 31.5,30.23 v34.8,30.23 | U5.PE14 46.11,32.14 44.45,30.48 v41.4,30.48
  Top 0.61: R8.1 5.71,6.1 5.33,6.48 5.33,9.7 Q2.1
  Bottom 0.305: v41.4,30.48 35.05,30.48 v34.8,30.23
FS_DM  (via drill 0.33)
  Top 0.305: J1.P2 7.61,28.97 10.29,26.29 v13.84,26.29 | U5.PA11 41.14,34.81 v42.16,33.78
  Bottom 0.305: v13.84,26.29 22.23,26.29 29.21,33.27 41.66,33.27 v42.16,33.78
FS_DP  (via drill 0.33)
  Top 0.305: J1.P3 6.73,28.32 10.16,24.89 v13.97,24.89 | U5.PA12 40.64,33.02 v40.13,32.51
  Bottom 0.305: v13.97,24.89 22.35,24.89 29.97,32.51 v40.13,32.51
FS_ID  (via drill 0.33)
  Top 0.305: J1.P4 5.86,27.67 10.29,23.24 v13.84,23.24 | U5.PA10 41.64,35.56 42.4,34.8 v43.94,34.8
  Bottom 0.305: v13.84,23.24 21.46,23.24 29.97,31.75 43.43,31.75 44.45,32.77 44.45,34.29 v43.94,34.8
FS_VBUS  (via drill 0.33)
  Top 0.305: v42.16,40.39 42.16,36.41 U5.PA9 | J1.P1 11.08,29.62 D1.A 19.49,28.89 v19.56,28.96
  Bottom 0.305: v42.16,40.39 41.66,40.89 34.54,40.89 22.61,28.96 v19.56,28.96
GND  (via drill 0.33)
  Top 0.559: 24.13,29.97 U4.2 27.91,29.97 C3.2
  other vias: 7.42,39.45 8.94,37.77 7.42,38.68 7.19,16.99 8.33,16.99 6.35,7.42 7.42,7.42 36.27,36.42 54.56,26.26 54.56,20.93 54.56,18.14 43.38,9.75 38.81,9.25 30.68,10.01 34.75,15.6 28.14,15.85 48.26,22.35 42.93,22.35 29.41,10.01 1.98,1.37 4.52,1.37 25.1,1.88 31.45,1.88 57.1,1.37 48.46,12.04 39.07,14.58 41.86,16.36 51,23.72 9.96,37.77 16.56,27.86 14.53,30.15 19.35,30.66 34.85,36.5 30.02,30.66 24.94,18.97 34.75,16.87 35,22.2 55.58,37.95
  pour GND (isolate 0.508, rank 5): -0.76,48.39 -0.51,-0.51 59.69,-0.76 59.69,48.39
  pour Top (isolate 0.254, rank 5): -0.76,48.39 -0.76,-0.76 59.69,-0.76 59.69,48.39
  pour Bottom (isolate 0.508, rank 5): -0.76,48.39 -0.51,-0.51 59.69,-0.76 59.69,48.39
  pour Bottom (isolate 0.508, rank 5): -0.51,48.39 -0.25,-0.51 59.94,-0.76 59.94,48.39
HALLA_DIGINPUT  (via drill 0.33)
  Top 0.305: U5.PE13 48.15,31.64 v47.5,30.99 | R9.2 9.4,4.83 10.16,5.59 12.19,5.59 12.95,4.83 12.95,4.06 HALLA.2
  Bottom 0.305: v47.5,30.99 44.7,28.19 30.73,28.19 28.96,26.42 28.96,22.86 26.67,20.57 24.13,20.57 23.62,20.07 23.62,11.18 18.03,5.59 14.99,5.59 13.97,4.57 HALLA.2
HALLB_DIGINPUT  (via drill 0.33)
  Top 0.305: R10.2 12.17,6.63 HALLB.2 13.97,7.11 14.99,6.1 17.53,6.1 20.83,9.4 v23.88,9.4 | 54.1,30.73 53.7,31.14 U5.PE12 49.43,31.14 v48.51,30.23
  Bottom 0.305: v48.51,30.23 45.72,27.43 31.5,27.43 29.97,25.91 29.97,22.35 25.15,17.53 25.15,10.67 v23.88,9.4
INT  (via drill 0.33)
  Top 0.305: U3.12 32.62,12.09 33.53,11.18 35.81,11.18 36.83,12.19 v36.83,18.03 | U5.PE0 38.09,24.14 38.86,23.37 v38.86,22.35
  Bottom 0.305: v38.86,22.35 38.86,21.84 37.85,20.83 37.85,19.05 v36.83,18.03
N$2
  Top 0.559: LED2.C 33.27,33.45 R4.2
N$3
  Top 0.61: LED1.C R11.2
N$4
  Top 0.305: C6.1 32.51,17.78 32.12,17.39 U3.20
N$5
  Top 0.305: R15.2 40.8,3.33 JP8.6
N$6
  Top 0.305: R17.2 40.67,7.21 JP8.5
N$8
  Top 0.457: 8.22,36.83 LED6.C
  Top 0.61: R3.2 8.22,36.83
N$11
  Top 0.305: U3.10 31.62,11.15 C8.1
N$20
  Top 0.305: R13.1 50.01,5.67 JTAG1.1
NRST  (via drill 0.33)
  Top 0.305: U5.NRST 45.14,19.63 45.72,19.05 C9.2 46.53,17.73 46.99,17.27 46.99,16.76 47.5,16.26 50.04,16.26 v51.82,16.26 | JTAG1.10 57.15,14.99 v56.64,15.49
  Top 0.406: 50.04,16.26 50.29,16 50.29,9.91 48.77,8.38 35.31,8.38 34.24,7.32 SW1.2 SW1.1
  Bottom 0.305: v56.64,15.49 55.88,16.26 v51.82,16.26
OSC_IN1
  Top 0.152: CTS1.3 42.23,12.26
  Top 0.305: U5.PH0 44.14,14.17 42.23,12.26
  pour Top (no thermals): 42.93,12.95 42.93,11.68 39.88,11.68 39.88,12.95
OSC_OUT1
  Top 0.305: U5.PH1 44.64,16.07 45.47,15.24
  pour Top (no thermals): 45.47,13.97 48.51,13.97 48.51,15.24 45.47,15.24
SCL1  (via drill 0.33)
  Top 0.152: 32.99,25.14 R6.1 33.02,25.05
  Top 0.305: U5.PB8 32.99,25.14 | U3.23 30.62,18.43 v32,19.81 | v33.02,26.42 33.02,25.05
  Bottom 0.305: v32,19.81 33.02,20.83 v33.02,26.42
SCL2
  Top 0.305: U5.PB10 57.78,33.14 58.67,34.04 58.67,39.12 57.4,40.39 47.25,40.39 LCD.2
SDA1
  Top 0.152: 33.02,23.09 R5.1
  Top 0.305: U5.PB9 34.52,24.64 R5.1 | U3.24 30.12,19.2 33.02,22.1 33.02,23.09
SDA2
  Top 0.305: LCD.3 41.02,43.56 45.47,39.12 56.9,39.12 57.66,38.35 57.66,34.54 56.75,33.64 U5.PB11
TCK  (via drill 0.33)
  Top 0.305: U5.PA14 38.26,34.64 39.12,33.78 39.12,30.99 40.64,29.46 v50.55,29.46 | JTAG1.4 v53.34,9.4
  Bottom 0.305: v53.34,9.4 53.59,9.65 56.64,9.65 58.17,11.18 58.17,26.92 55.75,29.34 55.63,29.46 v50.55,29.46
TDI  (via drill 0.33)
  Top 0.305: U5.PA15 35.71,34.14 v35.05,34.54 | v57.4,32 57.4,22.61 55.88,21.08 JTAG1.8
  Bottom 0.305: v57.4,32 54.61,32 52.32,34.29 52.32,36.32 50.55,38.1 40.13,38.1 37.34,35.31 35.56,35.31 v35.05,34.54
TDO
  Top 0.305: JTAG1.6 54.61,13.46 53.09,14.99 53.09,20.07 50.04,23.11 50.04,26.92 49.08,28.14 U5.PB3
TMS  (via drill 0.33)
  Top 0.305: JTAG1.2 52.07,12.7 v51.56,13.21 | U5.PA13 40.14,35.31 v39.62,34.8
  Bottom 0.305: v39.62,34.8 39.62,36.58 40.13,37.08 48.26,37.08 49.53,35.81 49.53,21.08 50.8,19.81 50.8,13.97 v51.56,13.21
VIN
  Top 1.016: U1.2 U1.1
  pour Top: 1.65,41.78 20.07,41.78 20.07,44.58 1.65,44.58

### Text on the board
tPlace: 5V | SDA2 | SCL2 | GND | 5V | 3.3V | IO | GND | * | 5V | IO | GND | *
bPlace: ESkate Board v2 / jeh.wicker@gmail.com / May 18 2015